# EAGLE design Exp_Board_RAMPS_0.1 (EAGLE 6.4)
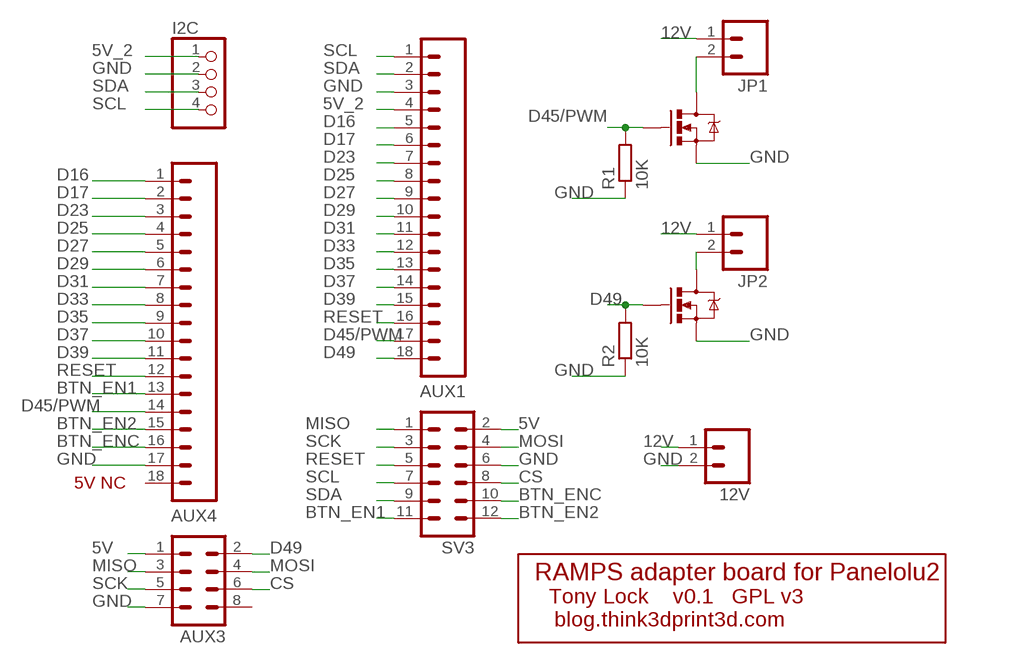
[diagram p0: schematic, sheet 1]

## Parts
12V  M02PTH  [1X02]
AUX1  SPARKFUN_M18_  [SPARKFUN_1X18]
AUX3  MA04-2  [MA04-2]
AUX4  SPARKFUN_M18_  [SPARKFUN_1X18]
I2C  REPRAPJR_PINHD-1X4  [REPRAPJR_1X04]
JP1  M02PTH  [1X02]
JP2  M02PTH  [1X02]
Q1  Transistor1  MOSFET-NCHANNELPTH2  [TO220V]
Q2  Transistor2  MOSFET-NCHANNELPTH2  [TO220V]
R1  10K  R-EU_0204/7  [0204/7]
R2  10K  R-EU_0204/7  [0204/7]
SV3  MA06-2_BACK  [MA06-2_BACK]

## Nets
5V: AUX3.1 SV3.2
5V_2: AUX1.4 I2C.1
12V: 12V.1 JP1.1 JP2.1
BTN_EN1: AUX4.13 SV3.11
BTN_EN2: AUX4.15 SV3.12
BTN_ENC: AUX4.16 SV3.10
CS: AUX3.6 SV3.8
D16: AUX1.5 AUX4.1
D17: AUX1.6 AUX4.2
D23: AUX1.7 AUX4.3
D25: AUX1.8 AUX4.4
D27: AUX1.9 AUX4.5
D29: AUX1.10 AUX4.6
D31: AUX1.11 AUX4.7
D33: AUX1.12 AUX4.8
D35: AUX1.13 AUX4.9
D37: AUX1.14 AUX4.10
D39: AUX1.15 AUX4.11
D45/PWM: AUX1.17 AUX4.14 Q1.1(G) R1.2
D49: AUX1.18 AUX3.2 Q2.1(G) R2.2
GND: 12V.2 AUX1.3 AUX3.7 AUX4.17 I2C.2 Q1.3(S) Q2.3(S) R1.1 R2.1 SV3.6
MISO: AUX3.3 SV3.1
MOSI: AUX3.4 SV3.4
N$1: JP1.2 Q1.2(D)
N$2: JP2.2 Q2.2(D)
RESET: AUX1.16 AUX4.12 SV3.5
SCK: AUX3.5 SV3.3
SCL: AUX1.1 I2C.4 SV3.7
SDA: AUX1.2 I2C.3 SV3.9
Unconnected: AUX3.8 AUX4.18

## Notes on the sheet
- 5V NC
- RAMPS adapter board for Panelolu2
- Tony Lock    v0.1   GPL v3
- blog.think3dprint3d.com

## Library data of the parts
12V JP1 JP2 = SparkFun-Connectors:M02: Header 2 Standard 2-pin 0.1" header. Use with straight break away headers (SKU : PRT-00116), right angle break away headers (PRT-00553), swiss pins (PRT-00743), machine pins (PRT-00117), and female headers (PRT-00115). Molex polarized connector foot print use with SKU : PRT-08233 with associated crimp pins and housings.
AUX1 AUX4 = RAMPS_1-41:SPARKFUN_M18
AUX3 = con-lstb_2:MA04-2: PIN HEADER; OC_FARNELL: unknown; OC_NEWARK: unknown
I2C = RAMPS_1-41:REPRAPJR_PINHD-1X4: PIN HEADER
Q1 Q2 = SparkFun-DiscreteSemi:MOSFET-NCHANNEL: Generic NMOS footprint
R1 R2 = resistor:R-EU_: RESISTOR, European symbol
SV3 = con-lstb:MA06-2_BACK: PIN HEADER; OC_FARNELL: unknown; OC_NEWARK: unknown

## Net classes
0 default: clearance 0.355 mm

## Board
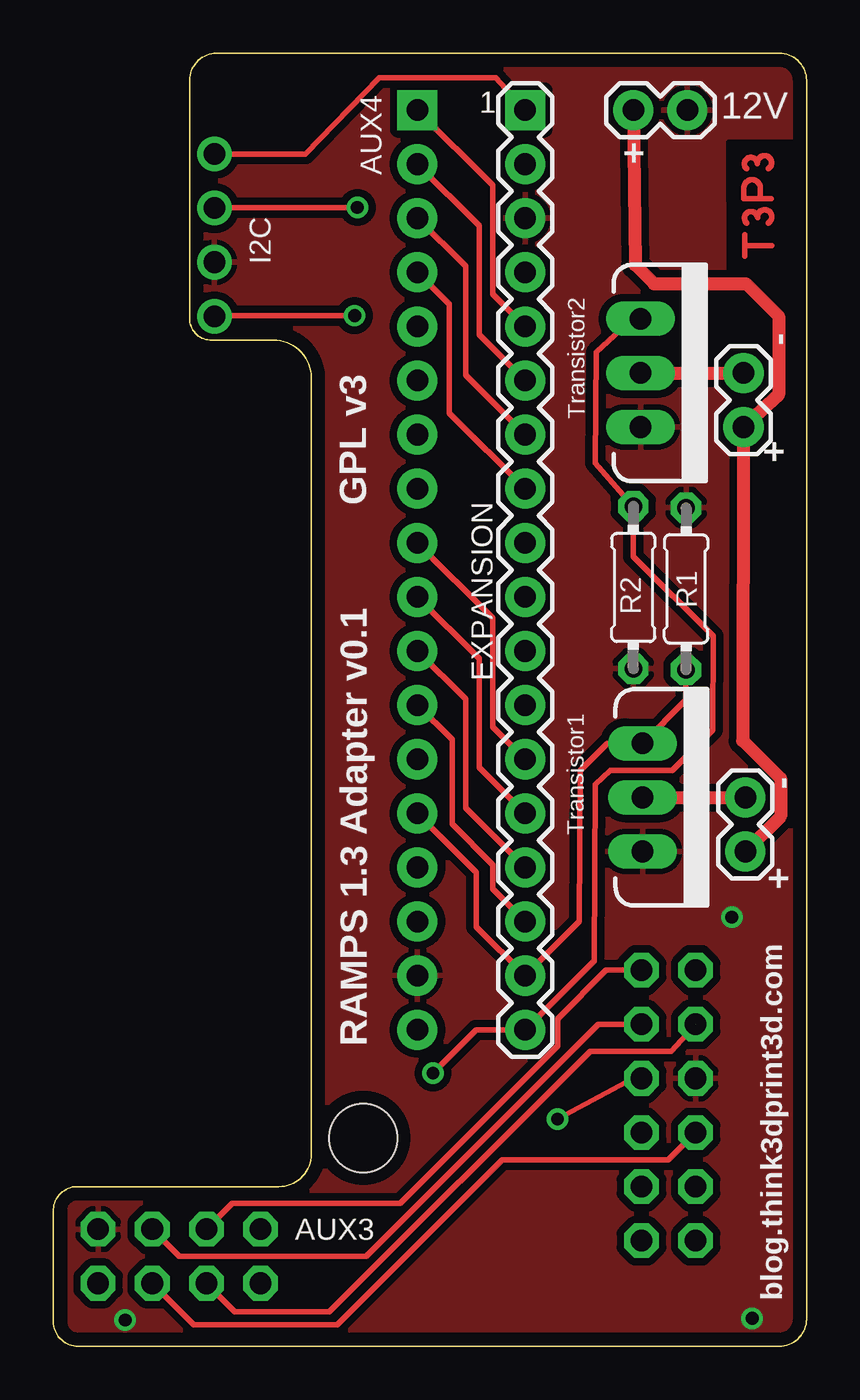
[diagram p1: board, top side]
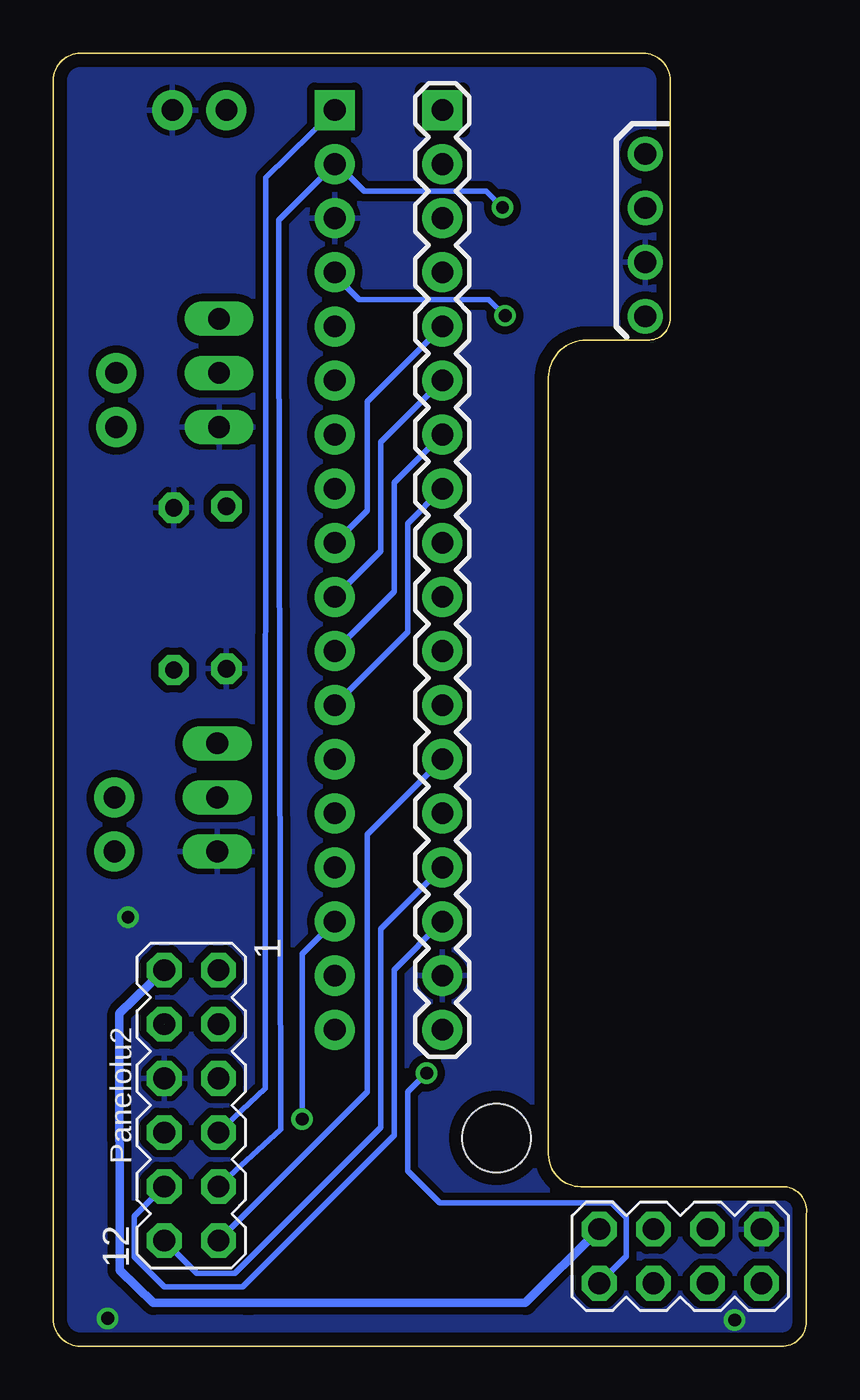
[diagram p2: board, bottom side, seen from below]

Size 35.35 x 60.71 mm. Coordinates in mm from the lower left corner, seen from the top.
Outline: 7.67,60.71 34.08,60.71 arc-90 35.35,59.44 35.35,1.27 arc-90 34.08,0 1.06,0 arc-90 0.01,1.26 0.01,6.21 arc-90 1,7.49 10.59,7.49 arc90 12.11,9.02 12.11,45.47 arc90 10.33,47.24 7.54,47.24 arc-97 6.4,48.26 6.4,59.44 arc-90 7.67,60.71
Outline: 7.67,60.71 7.54,60.71
Copper layers (1*16): Top 0.035mm / dielectric 1.5mm / Bottom 0.035mm
Design rules "default *": minimum track width 10mil, minimum drill 24mil, track to track 10mil, track to pad 10mil, pad to pad 10mil, via to via 10mil, smd to smd 8mil, copper to edge 24mil, drill to drill 8mil, minimum pad ring 12mil, minimum via ring 8mil, stop-mask expansion 4mil, vias tented up to drill 0mil, thermal gap 10mil
Holes 3.2 mm at 14.55,9.78

### Footprints (pad centres in the part's own frame; a part is rotated, then mirrored left to right if it is on the bottom)
1X02 = drill 1.016 pad 1.88: 1 0,0; 2 2.54,0
SPARKFUN_1X18 = drill 1.016 pad 1.88 square: 1 0,0 | drill 1.016 pad 1.88: 2 2.54,0; 3 5.08,0; 4 7.62,0; 5 10.16,0; 6 12.7,0; 7 15.24,0; 8 17.78,0; 9 20.32,0; 10 22.86,0; 11 25.4,0; 12 27.94,0; 13 30.48,0; 14 33.02,0; 15 35.56,0; 16 38.1,0; 17 40.64,0; 18 43.18,0
MA04-2 = drill 1.016 octagon: 1 -3.81,-1.27; 2 -3.81,1.27; 3 -1.27,-1.27; 4 -1.27,1.27; 5 1.27,-1.27; 6 1.27,1.27; 7 3.81,-1.27; 8 3.81,1.27
SPARKFUN_1X18_B = drill 1.016 pad 1.88 square: 1 0,0 | drill 1.016 pad 1.88: 2 2.54,0; 3 5.08,0; 4 7.62,0; 5 10.16,0; 6 12.7,0; 7 15.24,0; 8 17.78,0; 9 20.32,0; 10 22.86,0; 11 25.4,0; 12 27.94,0; 13 30.48,0; 14 33.02,0; 15 35.56,0; 16 38.1,0; 17 40.64,0; 18 43.18,0
REPRAPJR_1X04 = drill 1.016: 1 -2.54,0; 2 0,0; 3 2.54,0; 4 5.08,0
TO220V = drill 1.016 long: 1 -2.54,0; 2 0,0; 3 2.54,0
0204/7 = drill 0.813 octagon: 1 -3.81,0; 2 3.81,0
MA06-2_BACK = drill 1.016 octagon: 1 -6.35,-1.27; 2 -6.35,1.27; 3 -3.81,-1.27; 4 -3.81,1.27; 5 -1.27,-1.27; 6 -1.27,1.27; 7 1.27,-1.27; 8 1.27,1.27; 9 3.81,-1.27; 10 3.81,1.27; 11 6.35,-1.27; 12 6.35,1.27

### Placement (x,y rotation side)
12V  27.22,58.04 0 top
AUX1  22.14,58.04 270 top
AUX3  5.92,4.22 180 top
AUX4  SPARKFUN_M18_  [SPARKFUN_1X18_B]  17.09,58.04 270 top
I2C  7.57,50.9 90 top
JP1  32.48,23.23 90 top
JP2  32.39,43.15 90 top
Q1  27.66,25.77 270 top
Q2  27.57,45.69 270 top
R1  29.7,35.56 270 top
R2  27.22,35.62 90 top
SV3  28.88,11.31 270 top

### Tracks (layer width: path | path; a pad name or v marks a point on that pad's centre or on a via)
5V
  Bottom 0.406: SV3.2 32.25,15.63 32.24,3.56 30.65,2.03 26.34,2.03 26.08,2.03 13.19,2.03 AUX3.1
5V_2  (via drill 0.6)
  Top 0.254: I2C.1 7.6,48.39 v14.14,48.39
  Bottom 0.254: v14.14,48.39 14.91,49.15 21,49.15 22.15,50.29 AUX1.4
12V
  Top 0.61: 12V.1 27.31,50.77 28.2,49.89 32.52,49.89 34.05,48.36 34.05,44.68 JP2.1 32.36,28.43 34.13,26.66 34.13,24.88 JP1.1
BTN_EN1
  Bottom 0.254: AUX4.13 20.62,24.03 20.62,11.94 SV3.11
BTN_EN2
  Bottom 0.254: AUX4.15 19.99,19.59 19.99,10.29 26.84,3.43 28.62,3.43 SV3.12
BTN_ENC
  Bottom 0.254: AUX4.16 19.35,17.68 19.35,9.91 26.46,2.79 30.15,2.79 31.54,4.19 31.54,6.1 SV3.10
CS
  Top 0.254: SV3.8 28.87,8.76 21.08,8.76 13.32,1 6.6,1 AUX3.6
D16
  Top 0.254: AUX1.5 20.62,49.4 20.62,54.51 AUX4.1
D17
  Top 0.254: AUX1.6 19.99,47.5 19.99,52.61 AUX4.2
D23
  Top 0.254: AUX1.7 19.35,45.59 19.35,50.7 AUX4.3
D25
  Top 0.254: AUX1.8 18.59,43.82 18.59,48.92 AUX4.4
D27
  Bottom 0.254: AUX4.5 20.62,44.35 20.62,39.24 AUX1.9
D29
  Bottom 0.254: AUX4.6 19.99,42.45 19.99,37.34 AUX1.10
D31
  Bottom 0.254: AUX4.7 19.35,40.54 19.35,35.43 AUX1.11
D33
  Bottom 0.254: AUX4.8 18.72,38.64 18.72,33.53 AUX1.12
D35
  Top 0.254: AUX4.9 20.62,34.19 20.62,29.08 AUX1.13
D37
  Top 0.254: AUX4.10 19.99,32.29 19.99,27.18 AUX1.14
D39
  Top 0.254: AUX4.11 19.35,30.38 19.35,25.27 AUX1.15
D45/PWM
  Top 0.254: AUX4.14 19.86,22.25 19.86,19.68 AUX1.17 24.69,19.94 24.74,27.04 26.01,28.31 Q1.1 29.69,30.34 R1.2
D49  (via drill 0.6)
  Top 0.254: AUX1.18 | Q2.1 27.19,48.23 25.47,46.67 25.43,41.45 R2.2 27.23,37.08 30.97,33.34 30.96,28.94 29.05,27.04 26.13,27.04 25.45,26.36 25.4,18.1 AUX1.18 | v17.83,12.83 19.86,14.86 AUX1.18
  Bottom 0.254: v17.83,12.83 18.72,11.94 18.72,8.23 17.22,6.73 9.14,6.73 8.47,6.06 8.47,4.21 AUX3.2
GND  (via drill 0.6)
  other vias: 3.37,1.23 32.8,1.31 31.85,20.14
  pour Bottom (isolate 0.305): 0.61,-0.15 35.35,-0.13 35.35,60.83 0.58,61.12
  pour Top: 0.62,-0.14 35.4,0 35.4,60.92 0.64,61.21
MISO
  Top 0.254: SV3.1 25.96,17.66 23.67,15.37 23.67,14.1 16.29,6.72 8.41,6.72 AUX3.3
MOSI  (1 unrouted)
  Top 0.254: SV3.4 29,13.84 25.19,13.84 12.96,1.61 8.53,1.61 AUX3.4
N$1
  Top 0.61: Q1.2 JP1.2
N$2
  Top 0.61: Q2.2 JP2.2
N$3
  cutout Top: 31.73,50.69 34.57,50.72 34.55,56.54 31.7,56.54 31.73,50.89
N$4
  Top 0.254: 32.46,51.17 32.46,51.68 | 32.46,52.19 32.46,51.68 | 32.46,51.68 33.73,51.68
N$5
  Top 0.254: 32.54,52.74 arc-225 33.05,52.99 arc-243 33.56,52.74
N$6
  Top 0.254: 33.69,53.88 33.18,53.88 | 33.18,53.88 32.42,53.88 32.41,54.39 arc-180 33.18,54.39 33.18,53.88
N$7
  Top 0.254: 32.54,55.28 arc-225 33.05,55.53 arc-243 33.56,55.28
RESET  (via drill 0.6)
  Top 0.254: AUX4.12 18.72,28.48 18.72,24.51 20.62,22.61 20.62,21.46 AUX1.16 | v23.67,10.67 27.22,12.57 SV3.5
  Bottom 0.254: AUX1.16 23.67,18.41 v23.67,10.67
SCK
  Top 0.254: SV3.3 25.58,15.12 14.69,4.23 5.91,4.23 AUX3.5
SCL
  Top 0.254: I2C.4 11.83,55.98 15.3,59.55 20.76,59.55 AUX1.1
  Bottom 0.254: AUX1.1 25.38,54.85 25.4,12.11 SV3.7
SDA  (via drill 0.6)
  Top 0.254: I2C.3 7.6,53.47 v14.27,53.47
  Bottom 0.254: SV3.9 24.69,10.19 24.77,49.38 24.77,52.87 AUX1.2 22.02,55.5 20.75,54.23 15.03,54.23 v14.27,53.47

### Text on the board
tPlace: 1 | AUX4 | + | I2C | - | + | GPL v3 | EXPANSION | - | + | RAMPS 1.3 Adapter v0.1 | AUX3 | blog.think3dprint3d.com
bPlace: Panelolu2